# Altium schematic sheet Charger.SchDoc
size A4
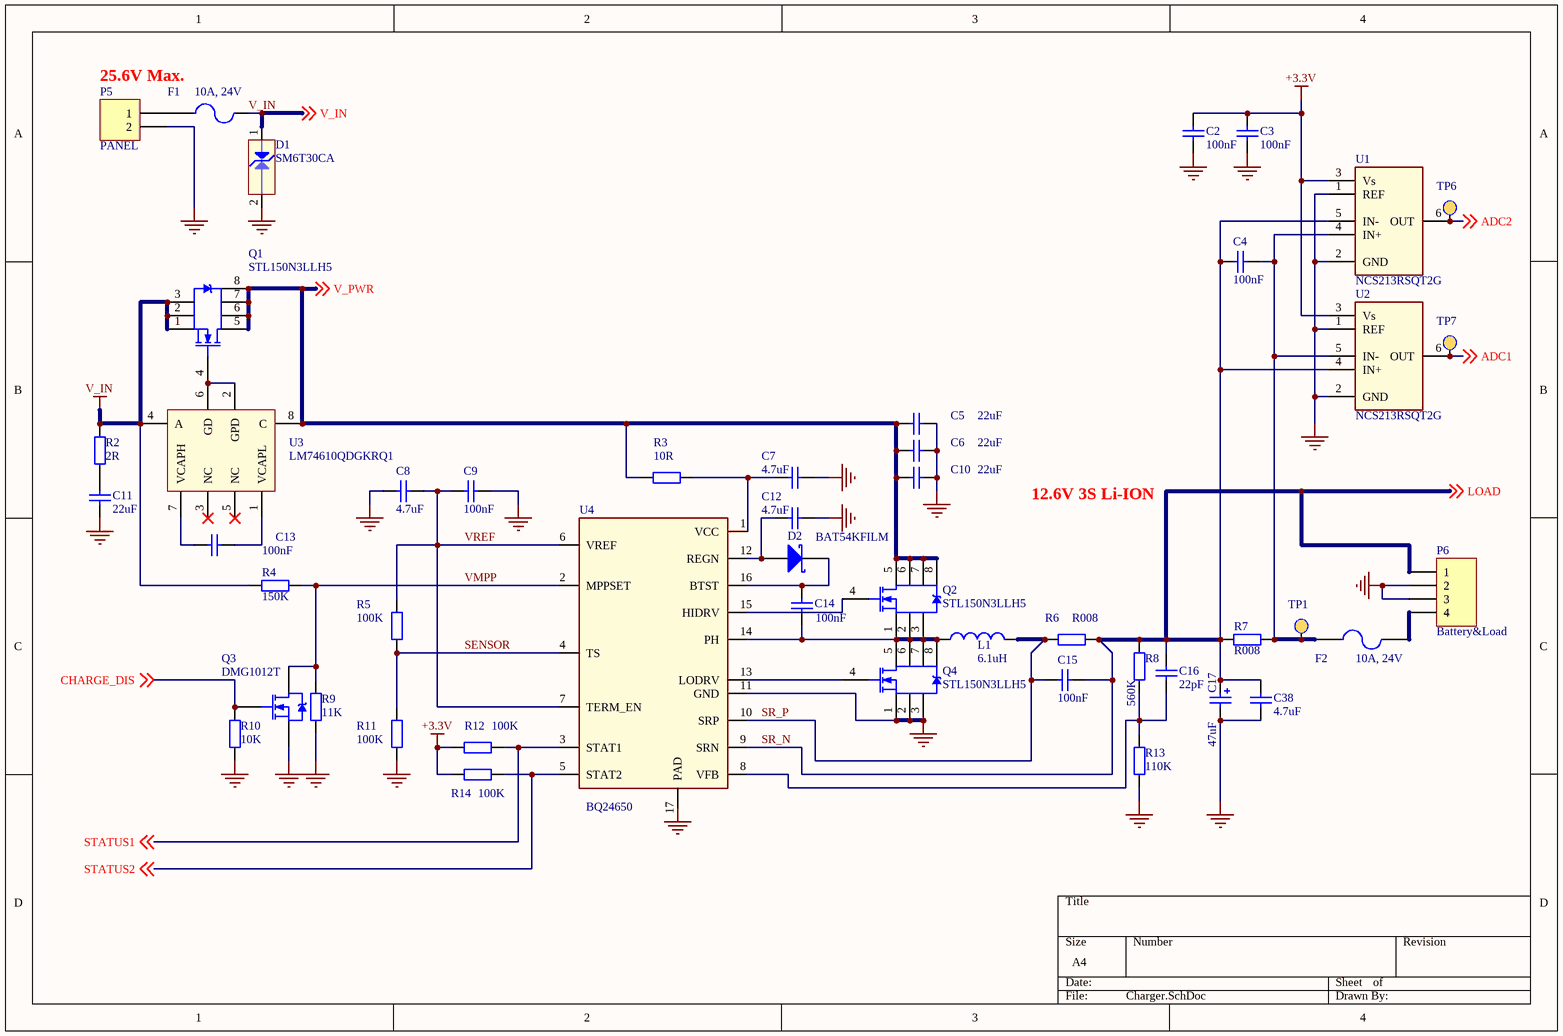
[diagram p0: Charger.SchDoc]

## Parts
C2  value 100nF  [C0402]  (hidden comment: Capacitor ceramic)
C3  value 100nF  [C0402]  (hidden comment: Capacitor ceramic)
C4  value 100nF  [C0402]  (hidden comment: Capacitor ceramic)
C5  value 22uF  [C1210]  (hidden comment: Capacitor ceramic)
C6  value 22uF  [C1210]  (hidden comment: Capacitor ceramic)
C7  value 4.7uF  [C0805]  (hidden comment: Capacitor ceramic)
C8  value 4.7uF  [C0805]  (hidden comment: Capacitor ceramic)
C9  value 100nF  [C0402]  (hidden comment: Capacitor ceramic)
C10  value 22uF  [C1210]  (hidden comment: Capacitor ceramic)
C11  value 22uF  [C1210]  (hidden comment: Capacitor ceramic)
C12  value 4.7uF  [C0805]  (hidden comment: Capacitor ceramic)
C13  value 100nF  [C0402]  (hidden comment: Capacitor ceramic)
C14  value 100nF  [C0402]  (hidden comment: Capacitor ceramic)
C15  value 100nF  [C0402]  (hidden comment: Capacitor ceramic)
C16  value 22pF  [C0402]  (hidden comment: Capacitor ceramic)
C17  value 47uF  [EIA-7343-31]  (hidden comment: Capacitor Tantalum)
C38  value 4.7uF  [C0805]  (hidden comment: Capacitor ceramic)
D1  SM6T30CA  [DO-214AA]
D2  BAT54KFILM  [SOD-523]
F1  10A, 24V  [F1206]
F2  10A, 24V  [F1206]
L1  value 6.1uH  [CDEP147]  (hidden comment: Power Inductor)
P5  PANEL  [TERM2pin5mm]
P6  Battery&Load  [TERM4pin5mm]
Q1  STL150N3LLH5  [PowerFLAT 5x6]
Q2  STL150N3LLH5  [PowerFLAT 5x6]
Q3  DMG1012T  [SOT-523_custom]
Q4  STL150N3LLH5  [PowerFLAT 5x6]
R2  value 2R  [R0805]  (hidden comment: Resistor)
R3  value 10R  [R0805]  (hidden comment: Resistor)
R4  value 150K  [R0402]  (hidden comment: Resistor)
R5  value 100K  [R0402]  (hidden comment: Resistor)
R6  value R008  [R2010]  (hidden comment: Resistor)
R7  value R008  [R2010]  (hidden comment: Resistor)
R8  value 560K  [R0402]  (hidden comment: Resistor)
R9  value 11K  [R0402]  (hidden comment: Resistor)
R10  value 10K  [R0402]  (hidden comment: Resistor)
R11  value 100K  [R0402]  (hidden comment: Resistor)
R12  value 100K  [R0402]  (hidden comment: Resistor)
R13  value 110K  [R0402]  (hidden comment: Resistor)
R14  value 100K  [R0402]  (hidden comment: Resistor)
TP1  Test_Point  [TEST_POINT]  (value not drawn)  (no BOM)
TP6  Test_Point  [TEST_POINT]  (value not drawn)  (no BOM)
TP7  Test_Point  [TEST_POINT]  (value not drawn)  (no BOM)
U1  NCS213RSQT2G  [SOT-363]
U2  NCS213RSQT2G  [SOT-363]
U3  LM74610QDGKRQ1  [TSSOP-8]
U4  BQ24650  [QFN-16_custom]

## Nets
+3.3V: C2.1 C3.1 R12.1 R14.1 U1.3(Vs) U2.3(Vs)
GND: C2.2 C3.2 C5.1 C6.1 C7.1 C8.1 C9.1 C10.1 C11.2 C12.1 C17.2 C38.2 D1.2(PIN2) P5.2 P6.2 P6.3 Q3.3(S) Q4.1(S) Q4.2(S) Q4.3(S) R9.1 R10.1 R11.1 R13.1 U1.1(REF) U1.2(GND) U2.1(REF) U2.2(GND) U4.11(GND) U4.17(PAD)
V_IN: D1.1(PIN1) F1.2 Q1.1(S) Q1.2(S) Q1.3(S) R2.2 R4.2 U3.4(A) ; off-sheet V_IN
ADC1: TP7.0 U2.6(OUT) ; off-sheet ADC1
ADC2: TP6.0 U1.6(OUT) ; off-sheet ADC2
CHARGE_DIS: Q3.1(G) R10.2 ; off-sheet CHARGE_DIS
SENSOR: R5.1 R11.2 U4.4(TS)
SR_N: C4.2 C15.1 C16.1 C17.1 C38.1 P6.1 R6.2 R7.2 R8.2 U1.5(IN-) U2.4(IN+) U4.9(SRN) ; off-sheet LOAD  [also labelled LOAD]
SR_P: C15.2 L1.2 R6.1 U4.10(SRP)
STATUS1: R12.2 U4.3(STAT1) ; off-sheet STATUS1
STATUS2: R14.2 U4.5(STAT2) ; off-sheet STATUS2
V_PWR: C5.2 C6.2 C10.2 Q1.5(D) Q1.6(D) Q1.7(D) Q1.8(D) Q2.5(D) Q2.6(D) Q2.7(D) Q2.8(D) R3.1 U3.8(C) ; off-sheet V_PWR
VMPP: Q3.2(D) R4.1 R9.2 U4.2(MPPSET)
VREF: C8.2 C9.2 R5.2 U4.6(VREF) U4.7(TERM_EN)
NetC4_1: C4.1 F2.1 R7.1 TP1.0 U1.4(IN+) U2.5(IN-)
NetC7_2: C7.2 R3.2 U4.1(VCC)
NetC11_1: C11.1 R2.1
NetC12_2: C12.2 D2.1(A) U4.12(REGN)
NetC13_1: C13.1 U3.7(VCAPH)
NetC13_2: C13.2 U3.1(VCAPL)
NetC14_1: C14.1 D2.2(K) U4.16(BTST)
NetC14_2: C14.2 L1.1 Q2.1(S) Q2.2(S) Q2.3(S) Q4.5(D) Q4.6(D) Q4.7(D) Q4.8(D) U4.14(PH)
NetC16_2: C16.2 R8.1 R13.2 U4.8(VFB)
NetF1_1: F1.1 P5.1
NetF2_2: F2.2 P6.4
NetQ1_4: Q1.4(G) U3.2(GPD) U3.6(GD)
NetQ2_4: Q2.4(G) U4.15(HIDRV)
NetQ4_4: Q4.4(G) U4.13(LODRV)

Not connected (* = marked no-connect by the designer): U3 3(NC)* 5(NC)*

## Notes on the sheet
- 25.6V Max.
- 12.6V 3S Li-ION

## Library data of the parts
C2-C4 C9 C13-C15 = Cap: Manufacturer: TDK Corporation; Manufacturer Part No.: CGA2B3X7R1V104K050BB; Part Description: Ceramic Capacitor; Specification: X7R, 35V, 10%; Link: https://www.digikey.com/product-detail/en/tdk-corporation/CGA2B3X7R1V104K050BB/445-6901-1-ND/2672919; Supplier: DigiKey; Supplier part number: 445-6901-1-ND
C5 C6 C10 C11 = Cap: Manufacturer: Taiyo Yuden; Manufacturer Part No.: GMK325BJ226MM-P; Part Description: Ceramic Capacitor; Specification: X5R, 35V, 20%; Link: https://www.digikey.com/product-detail/en/taiyo-yuden/GMK325BJ226MM-P/587-5853-1-ND/7674973; Supplier: DigiKey; Supplier part number: 587-5853-1-ND
C7 C8 C12 C38 = Cap: Manufacturer: Murata Electronics; Manufacturer Part No.: GRM219R6YA475KA73D; Part Description: Ceramic Capacitor; Specification: X5R, 35V, 10%; Link: https://www.digikey.com/product-detail/en/murata-electronics/GRM219R6YA475KA73D/490-7208-1-ND/3900454; Supplier: DigiKey; Supplier part number: 490-7208-1-ND
C16 = Cap: Manufacturer: Yageo; Manufacturer Part No.: CC0402JRNPO9BN220; Part Description: Ceramic Capacitor; Specification: NPO, 50V, 5%; Link: https://www.digikey.com/product-detail/en/yageo/CC0402JRNPO9BN220/311-1018-1-ND/302935; Supplier: DigiKey; Supplier part number: 311-1018-1-ND
C17 = Cap Pol2: Manufacturer: AVX Corporation; Manufacturer Part No.: TAJD476K016RNJ; Specification: TANT, 16V, 10%; Link: https://www.digikey.com/product-detail/en/avx-corporation/TAJD476K016RNJ/478-1739-1-ND/564771; Part Description: Capacitor Tantalum; Supplier: DigiKey; Supplier part number: 478-1739-1-ND
D1 = ESD_Diode: ESD Diode Symbol; Manufacturer: STMicroelectronics; Manufacturer Part No.: SM6T30CAY; Part Description: TVS DIODE; Specification: 30V, 0.6kW; Value: SM6T30CAY; Link: https://www.digikey.com/product-detail/en/stmicroelectronics/SM6T30CAY/497-10800-1-ND/2442951; Supplier: DigiKey; Supplier part number: 497-10800-1-ND
D2 = D Schottky: Schottky Diode; Manufacturer: STMicroelectronics; Part Description: Small signal Schottky diode; Specification: 40V, 0.3A; Manufacturer Part No.: BAT54KFILM; Supplier: DigiKey; Supplier part number: 497-5561-1-ND; Value: BAT54KFILM; Link: https://www.digikey.com/product-detail/en/stmicroelectronics/BAT54KFILM/497-5561-1-ND/1207053
F1 F2 = Fuse 2: SMD Fuse; Manufacturer: LITTELFUSE; Part Description: Fast Acting  Fuse; Value: 1206SFH100F/24-2; Specification: 100A; Link: https://uk.farnell.com/littelfuse/1206sfh100f-24-2/fuse-1206-10a/dp/1832124; Manufacturer Part No.: 1206SFH100F/24-2; Supplier: Farnell; Supplier part number: 1832124
L1 = Inductor: Manufacturer: Sumida America Components Inc.; Manufacturer Part No.: CDEP147NP-6R1MC-95; Specification: 11A, 20%; Link: https://www.digikey.com/product-detail/en/sumida-america-components-inc/CDEP147NP-6R1MC-95/308-1608-1-ND/3232383; Part Description: Power Inductor; Supplier: DigiKey; Supplier part number: 308-1608-1-ND
P5 = Header 2: Header, 2-Pin; Manufacturer: SAURO; Part Description: Terminal block; Value: MSG02001; Specification: 2pos. 5mm,  24A, 300V; Link: https://www.sauro.net/products/MSG02001/?product_id=MSG02001; Manufacturer Part No.: MSG02001; Supplier: Rutronik; Supplier part number: COTERM5720
P6 = Header 4: Header, 4-Pin; Manufacturer: SAURO; Manufacturer Part No.: MSG04001; Part Description: Terminal block; Specification: 4 pos. 5mm,  24A, 300V; Value: MSG04001; Link: https://www.sauro.net/products/MSG04001/?product_id=MSG04001; Supplier: Rutronik; Supplier part number: COTERM6351
Q1 Q2 Q4 = STL150N3LLH5: Power MOSFET N-channel; Manufacturer: STMicroelectronics; Part Description: P-channel Power MOSFET; Specification: 30V, 35A; Manufacturer Part No.: STL150N3LLH5; Supplier: Farnell; Supplier part number: 1752112RL; Value: STL150N3LLH5; Link: https://uk.farnell.com/stmicroelectronics/stl150n3llh5/mosfet-n-ch-30v-35a-powerflat6x5/dp/1752112RL
Q3 = NMOS-2: N-Channel Power MOSFET; Manufacturer: Diodes Incorporated; Manufacturer Part No.: DMG1012T-7; Part Description: N-Channel MOSFET; Specification: 20V, 0.63A; Value: DMG1012T-7; Supplier: DigiKey; Supplier part number: DMG1012T-7DICT-ND; Link: https://www.digikey.com/product-detail/en/diodes-incorporated/DMG1012T-7/DMG1012T-7DICT-ND/2181232
R2 = Res2: Manufacturer: Yageo; Manufacturer Part No.: RC0805JR-072RL; Part Description: Thick Film Resistor; Specification: 5% 0.125W; Link: https://www.digikey.com/product-detail/en/yageo/RC0805JR-072RL/311-2-0ARCT-ND/731214; Supplier: DigiKey; Supplier part number: 311-2.0ARCT-ND
R3 = Res2: Manufacturer: Yageo; Manufacturer Part No.: RC0805JR-07510RL; Part Description: Thick Film Resistor; Specification: 5% 0.125W; Link: https://www.digikey.com/product-detail/en/yageo/RC0805JR-07510RL/311-510ARCT-ND/731290; Supplier: DigiKey; Supplier part number: 311-510ARCT-ND
R4 = Res2: Manufacturer: Yageo; Manufacturer Part No.: RC0402JR-07150KL; Part Description: Thick Film Resistor; Specification: 5% 0,063W; Link: https://www.digikey.com/product-detail/en/yageo/RC0402JR-07150KL/311-150KJRCT-ND/729372; Supplier: DigiKey; Supplier part number: 311-150KJRCT-ND
R5 R11 R12 R14 = Res2: Manufacturer: Yageo; Manufacturer Part No.: RC0402JR-07100KL; Part Description: Thick Film Resistor; Specification: 5% 0,063W; Link: https://www.digikey.com/product-detail/en/yageo/RC0402JR-07100KL/311-100KJRCT-ND/729363; Supplier: DigiKey; Supplier part number: 311-100KJRCT-ND
R6 R7 = Res2: Manufacturer: Rohm Semiconductor; Manufacturer Part No.: PMR50HZPFU8L00; Part Description: Thick Film Resistor; Specification: 1% 1W; Link: https://www.digikey.com/product-detail/en/rohm-semiconductor/PMR50HZPFU8L00/RHM-008ASCT-ND/2094542; Supplier: DigiKey; Supplier part number: RHM.008ASCT-ND
R8 = Res2: Manufacturer: Yageo; Manufacturer Part No.: RC0402JR-07560KL; Part Description: Thick Film Resistor; Specification: 5% 0,063W; Link: https://www.digikey.com/product-detail/en/yageo/RC0402JR-07560KL/311-560KJRCT-ND/729440; Supplier: DigiKey; Supplier part number: 311-560KJRCT-ND
R9 = Res2: Manufacturer: Yageo; Manufacturer Part No.: RC0402JR-0711KL; Part Description: Thick Film Resistor; Specification: 5% 0,063W; Link: https://www.digikey.com/product-detail/en/yageo/RC0402JR-0711KL/311-11KJRCT-ND/729367; Supplier: DigiKey; Supplier part number: 311-11KJRCT-ND
R10 = Res2: Manufacturer: Yageo; Manufacturer Part No.: RC0100JR-0710KL; Part Description: Thick Film Resistor; Specification: 5% 0.03W; Link: https://www.digikey.com/product-detail/en/yageo/RC0100JR-0710KL/311-10KDHCT-ND/2254412; Supplier: DigiKey; Supplier part number: 311-10KDHCT-ND
R13 = Res2: Manufacturer: Yageo; Manufacturer Part No.: RC0402JR-07110KL; Part Description: Thick Film Resistor; Specification: 5% 0,063W; Link: https://www.digikey.com/product-detail/en/yageo/RC0402JR-07110KL/311-110KJRCT-ND/729366; Supplier: DigiKey; Supplier part number: 311-110KJRCT-ND
TP1 TP6 TP7 = Test_Point: Test Point
U1 U2 = NCS21xR: Current-Shunt Monitor; Manufacturer: ON Semiconductor; Specification: x50, 80uA, 26V; Link: https://www.digikey.com/product-detail/en/on-semiconductor/NCS213RSQT2G/NCS213RSQT2GOSCT-ND/9169239; Manufacturer Part No.: NCS213RSQT2G; Part Description: Current-Shunt Monitor; Supplier: DigiKey; Supplier part number: NCS213RSQT2GOSCT-ND; Value: NCS213RSQT2G
U3 = LM74610-Q1: Smart Diode Controller; Manufacturer: TI; Specification: 42V, 30uA; Link: https://www.digikey.com/product-detail/en/texas-instruments/LM74610QDGKRQ1/296-43067-1-ND/5722225; Manufacturer Part No.: LM74610QDGKRQ1; Part Description: Smart Diode Controller; Supplier: DigiKey; Supplier part number: 296-43067-1-ND; Value: LM74610QDGKRQ1
U4 = BQ24650: Maximum Power Point Charger; Manufacturer: TI; Manufacturer Part No.: BQ24650RVAR; Part Description: Battery Charge Controller; Value: BQ24650RVAT; Specification: 28V, MPPT; Link: https://www.digikey.com/product-detail/en/texas-instruments/BQ24650RVAR/296-46287-1-ND/7033462; Supplier: DigiKey; Supplier part number: 296-46287-1-ND